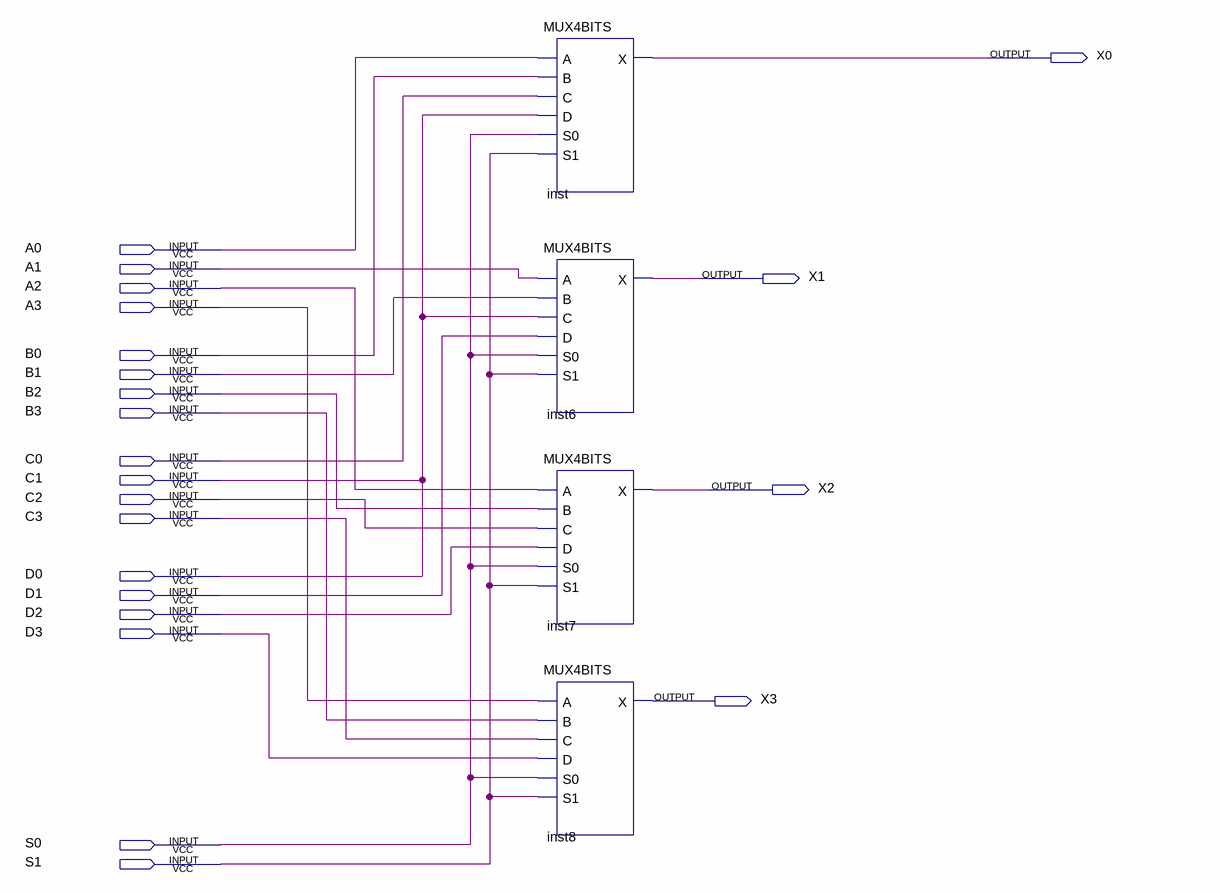
[diagram p0: schematic sheet]
// Quartus schematic BLOCO8.bdf as structural Verilog: 4 symbols, 22 pins
module BLOCO8 (
  input  A0,
  input  A1,
  input  A2,
  input  A3,
  input  B0,
  input  B1,
  input  B2,
  input  B3,
  input  C0,
  input  C1,
  input  C2,
  input  C3,
  input  D0,
  input  D1,
  input  D2,
  input  D3,
  input  S0,
  input  S1,
  output X0,
  output X1,
  output X2,
  output X3
);

  MUX4BITS inst (.A(A0), .B(B0), .C(C0), .D(C1), .S0(S0), .S1(S1), .X(X0));
  MUX4BITS inst6 (.A(A1), .B(B1), .C(C1), .D(D1), .S0(S0), .S1(S1), .X(X1));
  MUX4BITS inst7 (.A(A2), .B(B2), .C(C2), .D(D2), .S0(S0), .S1(S1), .X(X2));
  MUX4BITS inst8 (.A(A3), .B(B3), .C(C3), .D(D3), .S0(S0), .S1(S1), .X(X3));

  assign D0 = C1;
endmodule
